# EAGLE design debug_adaptor (EAGLE 6.1)
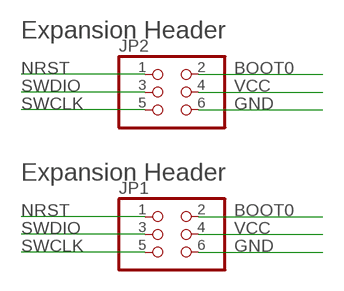
[diagram p0: schematic, sheet 1]

## Parts
JP1  PINHD-2X3  [2X03]
JP2  PINHD-2X3  [2X03]

## Nets
BOOT0: JP1.2 JP2.2
GND: JP1.6 JP2.6
NRST: JP1.1 JP2.1
SWCLK: JP1.5 JP2.5
SWDIO: JP1.3 JP2.3
VCC: JP1.4 JP2.4

## Notes on the sheet
- Expansion Header
- Expansion Header

## Library data of the parts
JP1 = pinhead:PINHD-2X3: PIN HEADER
JP2 = mux:PINHD-2X3: PIN HEADER

## Board
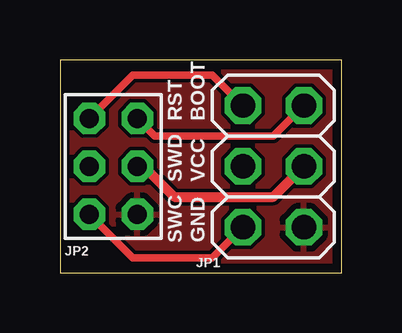
[diagram p1: board, top side]
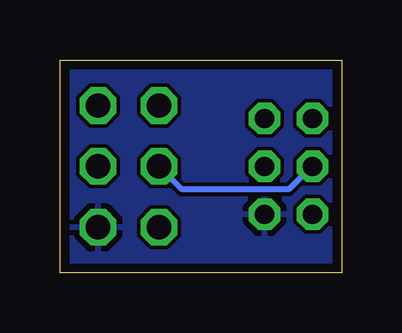
[diagram p2: board, bottom side, seen from below]

Size 11.75 x 8.89 mm. Coordinates in mm from the lower left corner, seen from the top.
Outline: 0,0 11.75,0 11.75,8.89 0,8.89 0,0
Copper layers (1*16): Top 0.0356mm / dielectric 1.5011mm / Bottom 0.0356mm
Design rules: minimum track width 6mil, minimum drill 13mil, track to track 6mil, track to pad 6mil, pad to pad 6mil, via to via 6mil, smd to smd 6mil, copper to edge 15mil, drill to drill 6mil, minimum pad ring 10mil, minimum via ring 10mil, stop-mask expansion 4mil, vias tented up to drill 13mil, thermal gap 10mil

### Footprints (pad centres in the part's own frame; a part is rotated, then mirrored left to right if it is on the bottom)
2X03 = drill 1.016 octagon: 1 -2.54,-1.27; 2 -2.54,1.27; 3 0,-1.27; 4 0,1.27; 5 2.54,-1.27; 6 2.54,1.27
2X03' = drill 0.8 octagon: 1 -2,-1; 2 -2,1; 3 0,-1; 4 0,1; 5 2,-1; 6 2,1

### Placement (x,y rotation side)
JP1  8.89,4.45 270 top
JP2  [2X03']  2.22,4.45 270 top

### Tracks (layer width: path | path; a pad name or v marks a point on that pad's centre or on a via)
BOOT0
  Top 0.305: JP1.2 8.89,5.71 3.95,5.71 JP2.2
GND
  pour Bottom: 0,0 0,8.89 11.75,8.89 11.75,0
  pour Top: 0,0 0,8.89 11.75,8.89 11.75,0
NRST
  Top 0.305: JP1.1 6.35,8.26 3.03,8.26 JP2.1
SWCLK
  Top 0.305: JP1.5 6.35,0.64 3.03,0.64 JP2.5
SWDIO
  Bottom 0.254: JP2.3 1.22,4.49 2.22,3.49 6.67,3.49 JP1.3
VCC
  Top 0.406: JP1.4 8.89,3.17 4.76,3.17 3.49,4.45 JP2.4

### Text on the board
tPlace: RST | BOOT | SWD | VCC | SWC | GND